# EAGLE schematic acoustics (EAGLE 9.1.3)

## Sheet 1 of 5: Connectors
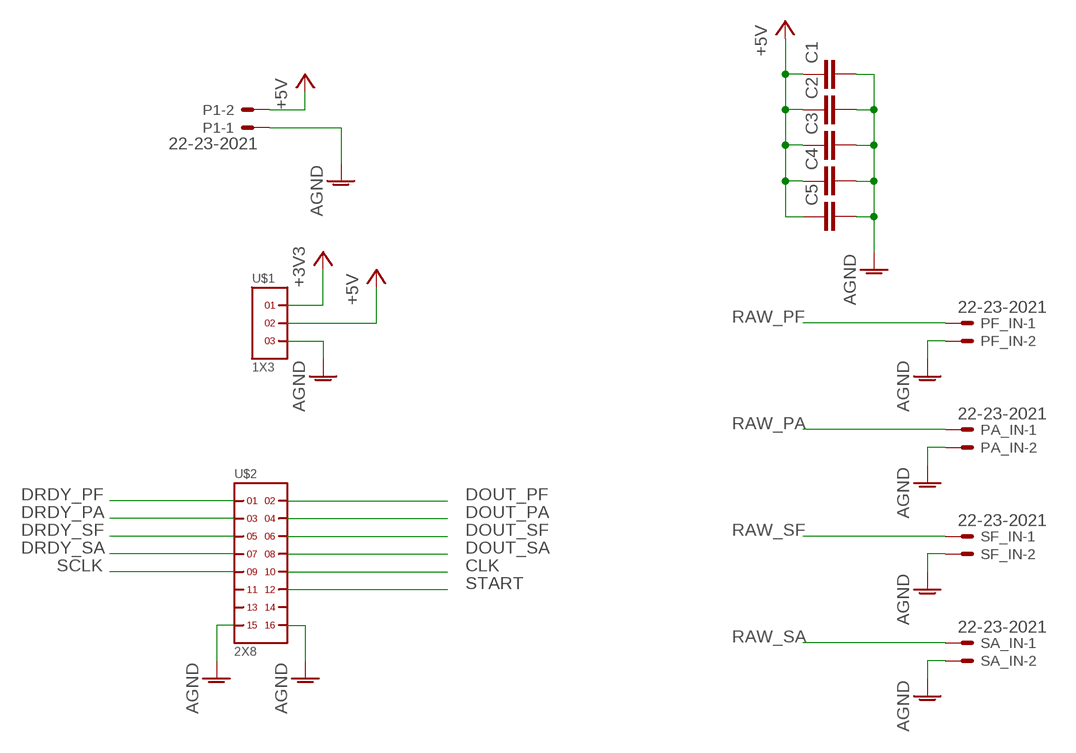
[diagram p0: schematic, sheet 1]

### Parts
C1  C2,5-3  [C2.5-3]
C2  C2,5-3  [C2.5-3]
C3  C2,5-3  [C2.5-3]
C4  C2,5-3  [C2.5-3]
C5  C2,5-3  [C2.5-3]
P1  22-23-2021  [22-23-2021]
PA_IN  22-23-2021  [22-23-2021]
PF_IN  22-23-2021  [22-23-2021]
SA_IN  22-23-2021  [22-23-2021]
SF_IN  22-23-2021  [22-23-2021]
U$1  1X3  [1X3]
U$2  2X8  [2X8]

### Nets
+3V3: U$1.1 ; also sheet 2,3,4,5
+5V: C1.1 C2.1 C3.1 C4.1 C5.1 P1.2 U$1.2
CLK: U$2.10 ; also sheet 5
DOUT_PA: U$2.4 ; also sheet 5
DOUT_PF: U$2.2 ; also sheet 5
DOUT_SA: U$2.8 ; also sheet 5
DOUT_SF: U$2.6 ; also sheet 5
DRDY_PA: U$2.3 ; also sheet 5
DRDY_PF: U$2.1 ; also sheet 5
DRDY_SA: U$2.7 ; also sheet 5
DRDY_SF: U$2.5 ; also sheet 5
GND: C1.2 C2.2 C3.2 C4.2 C5.2 P1.1 PA_IN.2 PF_IN.2 SA_IN.2 SF_IN.2 U$1.3 U$2.15 U$2.16 ; supply symbol labelled AGND ; also sheet 2,3,4,5
RAW_PA: PA_IN.1 ; also sheet 2
RAW_PF: PF_IN.1 ; also sheet 2
RAW_SA: SA_IN.1 ; also sheet 2
RAW_SF: SF_IN.1 ; also sheet 2
SCLK: U$2.9 ; also sheet 5
START: U$2.12 ; also sheet 5
Unconnected: U$2.11 U$2.13 U$2.14

## Sheet 2 of 5: Pre-amp
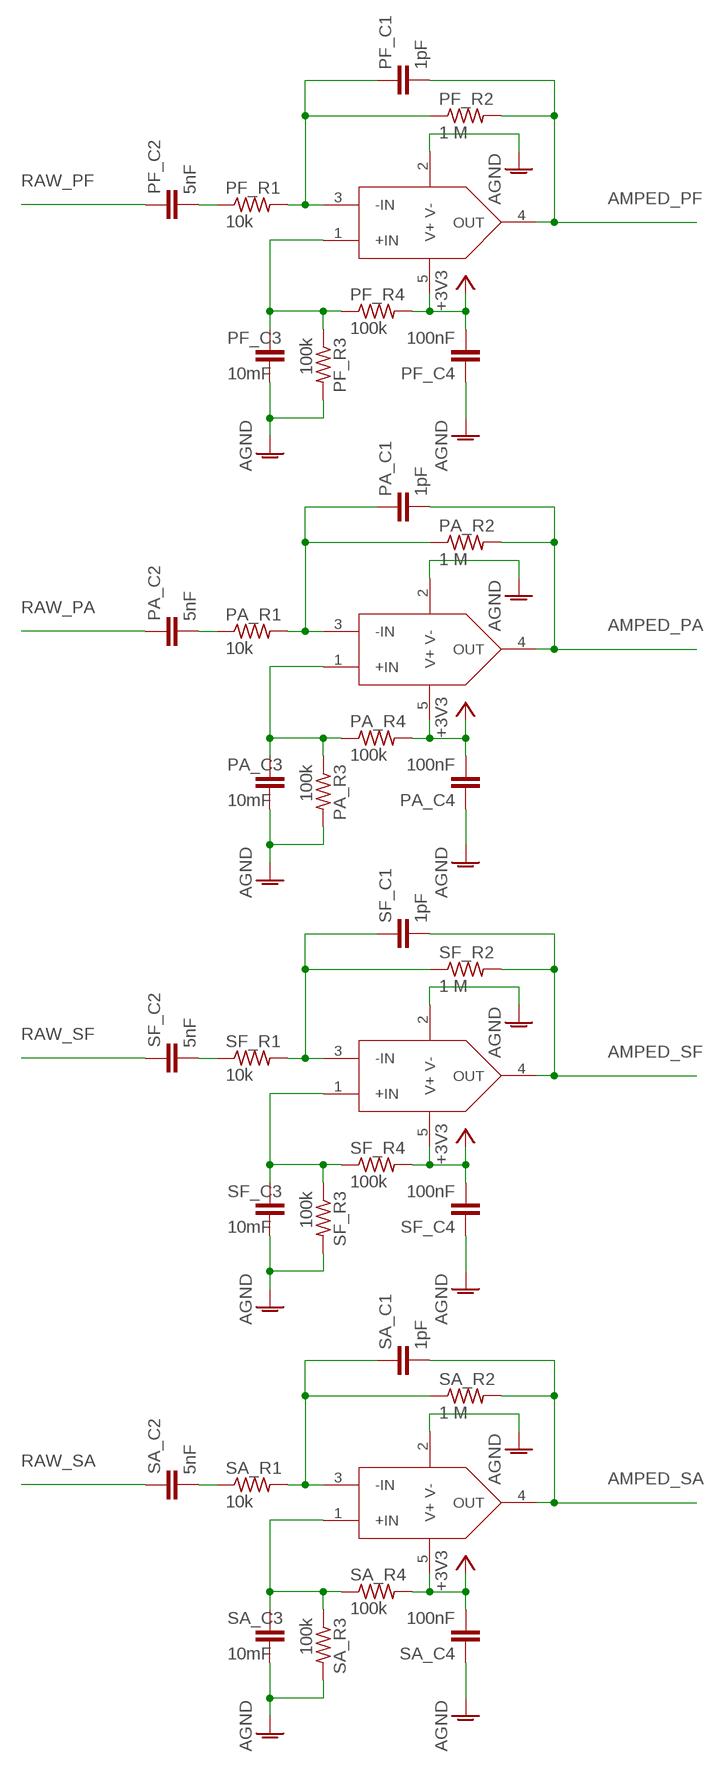
[diagram p1: schematic, sheet 2]

### Parts
H4_PREAMP4  TLV6741  [SC70-5]
PA_C1  1pF  C-EUC0603  [C0603]
PA_C2  5nF  C-EUC0603  [C0603]
PA_C3  10mF  C-EUC0603  [C0603]
PA_C4  100nF  C-EUC0603  [C0603]
PA_PREAMP  TLV6741  [SC70-5]
PA_R1  10k  R-US_R0603  [R0603]
PA_R2  1 M  R-US_R0603  [R0603]
PA_R3  100k  R-US_R0603  [R0603]
PA_R4  100k  R-US_R0603  [R0603]
PF_C1  1pF  C-EUC0603  [C0603]
PF_C2  5nF  C-EUC0603  [C0603]
PF_C3  10mF  C-EUC0603  [C0603]
PF_C4  100nF  C-EUC0603  [C0603]
PF_PREAMP  TLV6741  [SC70-5]
PF_R1  10k  R-US_R0603  [R0603]
PF_R2  1 M  R-US_R0603  [R0603]
PF_R3  100k  R-US_R0603  [R0603]
PF_R4  100k  R-US_R0603  [R0603]
SA_C1  1pF  C-EUC0603  [C0603]
SA_C2  5nF  C-EUC0603  [C0603]
SA_C3  10mF  C-EUC0603  [C0603]
SA_C4  100nF  C-EUC0603  [C0603]
SA_R1  10k  R-US_R0603  [R0603]
SA_R2  1 M  R-US_R0603  [R0603]
SA_R3  100k  R-US_R0603  [R0603]
SA_R4  100k  R-US_R0603  [R0603]
SF_C1  1pF  C-EUC0603  [C0603]
SF_C2  5nF  C-EUC0603  [C0603]
SF_C3  10mF  C-EUC0603  [C0603]
SF_C4  100nF  C-EUC0603  [C0603]
SF_PREAMP3  TLV6741  [SC70-5]
SF_R1  10k  R-US_R0603  [R0603]
SF_R2  1 M  R-US_R0603  [R0603]
SF_R3  100k  R-US_R0603  [R0603]
SF_R4  100k  R-US_R0603  [R0603]

### Nets
+3V3: H4_PREAMP4.5(V+) PA_C4.2 PA_PREAMP.5(V+) PA_R4.2 PF_C4.2 PF_PREAMP.5(V+) PF_R4.2 SA_C4.2 SA_R4.2 SF_C4.2 SF_PREAMP3.5(V+) SF_R4.2 ; also sheet 1,3,4,5
AMPED_PA: PA_C1.2 PA_PREAMP.4(OUT) PA_R2.2 ; also sheet 3
AMPED_PF: PF_C1.2 PF_PREAMP.4(OUT) PF_R2.2 ; also sheet 3
AMPED_SA: H4_PREAMP4.4(OUT) SA_C1.2 SA_R2.2 ; also sheet 3
AMPED_SF: SF_C1.2 SF_PREAMP3.4(OUT) SF_R2.2 ; also sheet 3
GND: H4_PREAMP4.2(V-) PA_C3.2 PA_C4.1 PA_PREAMP.2(V-) PA_R3.2 PF_C3.2 PF_C4.1 PF_PREAMP.2(V-) PF_R3.2 SA_C3.2 SA_C4.1 SA_R3.2 SF_C3.2 SF_C4.1 SF_PREAMP3.2(V-) SF_R3.2 ; supply symbol labelled AGND ; also sheet 1,3,4,5
N$133: PF_C2.2 PF_R1.1
N$134: PF_C1.1 PF_PREAMP.3(-IN) PF_R1.2 PF_R2.1
N$135: PF_C3.1 PF_PREAMP.1(+IN) PF_R3.1 PF_R4.1
N$137: PA_C2.2 PA_R1.1
N$138: PA_C1.1 PA_PREAMP.3(-IN) PA_R1.2 PA_R2.1
N$139: PA_C3.1 PA_PREAMP.1(+IN) PA_R3.1 PA_R4.1
N$141: SF_C2.2 SF_R1.1
N$142: SF_C1.1 SF_PREAMP3.3(-IN) SF_R1.2 SF_R2.1
N$143: SF_C3.1 SF_PREAMP3.1(+IN) SF_R3.1 SF_R4.1
N$145: SA_C2.2 SA_R1.1
N$146: H4_PREAMP4.3(-IN) SA_C1.1 SA_R1.2 SA_R2.1
N$147: H4_PREAMP4.1(+IN) SA_C3.1 SA_R3.1 SA_R4.1
RAW_PA: PA_C2.1 ; also sheet 1
RAW_PF: PF_C2.1 ; also sheet 1
RAW_SA: SA_C2.1 ; also sheet 1
RAW_SF: SF_C2.1 ; also sheet 1

## Sheet 3 of 5: Differential amplifier
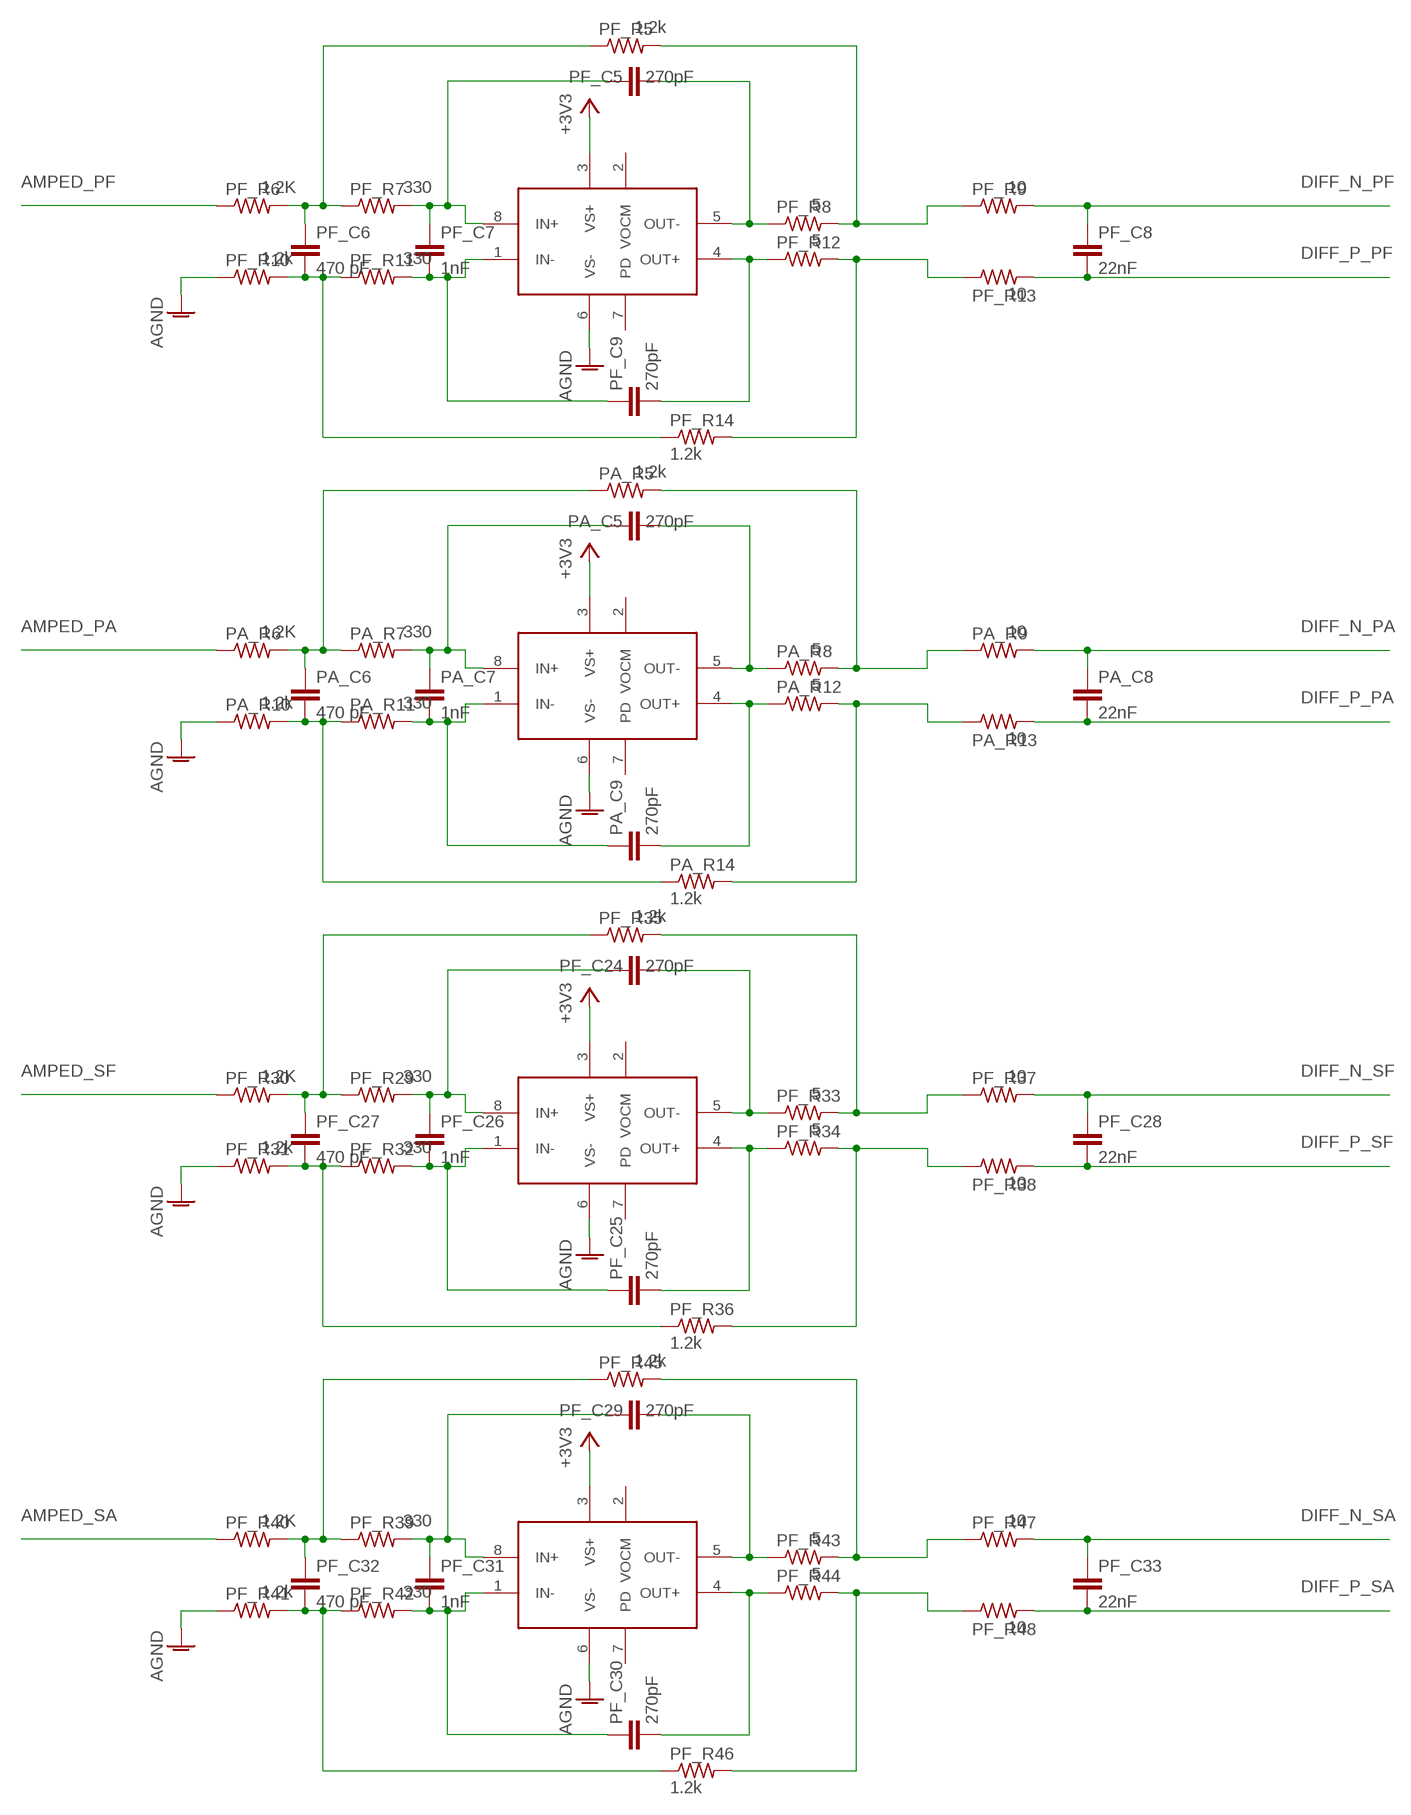
[diagram p2: schematic, sheet 3]

### Parts
PA_C5  270pF  C-EUC0603  [C0603]
PA_C6  470 pF  C-EUC0603  [C0603]
PA_C7  1nF  C-EUC0603  [C0603]
PA_C8  22nF  C-EUC0603  [C0603]
PA_C9  270pF  C-EUC0603  [C0603]
PA_DA  THS4551  [VSSOP-8]
PA_R5  1.2k  R-US_R0603  [R0603]
PA_R6  1.2K  R-US_R0603  [R0603]
PA_R7  330  R-US_R0603  [R0603]
PA_R8  5  R-US_R0603  [R0603]
PA_R9  10  R-US_R0603  [R0603]
PA_R10  1.2k  R-US_R0603  [R0603]
PA_R11  330  R-US_R0603  [R0603]
PA_R12  5  R-US_R0603  [R0603]
PA_R13  10  R-US_R0603  [R0603]
PA_R14  1.2k  R-US_R0603  [R0603]
PF_C5  270pF  C-EUC0603  [C0603]
PF_C6  470 pF  C-EUC0603  [C0603]
PF_C7  1nF  C-EUC0603  [C0603]
PF_C8  22nF  C-EUC0603  [C0603]
PF_C9  270pF  C-EUC0603  [C0603]
PF_C24  270pF  C-EUC0603  [C0603]
PF_C25  270pF  C-EUC0603  [C0603]
PF_C26  1nF  C-EUC0603  [C0603]
PF_C27  470 pF  C-EUC0603  [C0603]
PF_C28  22nF  C-EUC0603  [C0603]
PF_C29  270pF  C-EUC0603  [C0603]
PF_C30  270pF  C-EUC0603  [C0603]
PF_C31  1nF  C-EUC0603  [C0603]
PF_C32  470 pF  C-EUC0603  [C0603]
PF_C33  22nF  C-EUC0603  [C0603]
PF_DA  THS4551  [VSSOP-8]
PF_DA2  THS4551  [VSSOP-8]
PF_DA3  THS4551  [VSSOP-8]
PF_R5  1.2k  R-US_R0603  [R0603]
PF_R6  1.2K  R-US_R0603  [R0603]
PF_R7  330  R-US_R0603  [R0603]
PF_R8  5  R-US_R0603  [R0603]
PF_R9  10  R-US_R0603  [R0603]
PF_R10  1.2k  R-US_R0603  [R0603]
PF_R11  330  R-US_R0603  [R0603]
PF_R12  5  R-US_R0603  [R0603]
PF_R13  10  R-US_R0603  [R0603]
PF_R14  1.2k  R-US_R0603  [R0603]
PF_R29  330  R-US_R0603  [R0603]
PF_R30  1.2K  R-US_R0603  [R0603]
PF_R31  1.2k  R-US_R0603  [R0603]
PF_R32  330  R-US_R0603  [R0603]
PF_R33  5  R-US_R0603  [R0603]
PF_R34  5  R-US_R0603  [R0603]
PF_R35  1.2k  R-US_R0603  [R0603]
PF_R36  1.2k  R-US_R0603  [R0603]
PF_R37  10  R-US_R0603  [R0603]
PF_R38  10  R-US_R0603  [R0603]
PF_R39  330  R-US_R0603  [R0603]
PF_R40  1.2K  R-US_R0603  [R0603]
PF_R41  1.2k  R-US_R0603  [R0603]
PF_R42  330  R-US_R0603  [R0603]
PF_R43  5  R-US_R0603  [R0603]
PF_R44  5  R-US_R0603  [R0603]
PF_R45  1.2k  R-US_R0603  [R0603]
PF_R46  1.2k  R-US_R0603  [R0603]
PF_R47  10  R-US_R0603  [R0603]
PF_R48  10  R-US_R0603  [R0603]

### Nets
+3V3: PA_DA.3(VS+) PF_DA2.3(VS+) PF_DA3.3(VS+) PF_DA.3(VS+) ; also sheet 1,2,4,5
AMPED_PA: PA_R6.1 ; also sheet 2
AMPED_PF: PF_R6.1 ; also sheet 2
AMPED_SA: PF_R40.1 ; also sheet 2
AMPED_SF: PF_R30.1 ; also sheet 2
DIFF_N_PA: PA_C8.1 PA_R9.2 ; also sheet 5
DIFF_N_PF: PF_C8.1 PF_R9.2 ; also sheet 5
DIFF_N_SA: PF_C33.1 PF_R47.2 ; also sheet 5
DIFF_N_SF: PF_C28.1 PF_R37.2 ; also sheet 5
DIFF_P_PA: PA_C8.2 PA_R13.2 ; also sheet 5
DIFF_P_PF: PF_C8.2 PF_R13.2 ; also sheet 5
DIFF_P_SA: PF_C33.2 PF_R48.2 ; also sheet 5
DIFF_P_SF: PF_C28.2 PF_R38.2 ; also sheet 5
GND: PA_DA.6(VS-) PA_R10.1 PF_DA2.6(VS-) PF_DA3.6(VS-) PF_DA.6(VS-) PF_R10.1 PF_R31.1 PF_R41.1 ; supply symbol labelled AGND ; also sheet 1,2,4,5
N$1: PA_C5.2 PA_DA.5(OUT-) PA_R8.1
N$2: PA_C5.1 PA_C7.1 PA_DA.8(IN+) PA_R7.2
N$3: PA_C7.2 PA_C9.1 PA_DA.1(IN-) PA_R11.2
N$4: PA_C6.1 PA_R5.1 PA_R6.2 PA_R7.1
N$5: PA_C6.2 PA_R10.2 PA_R11.1 PA_R14.1
N$6: PA_C9.2 PA_DA.4(OUT+) PA_R12.1
N$7: PA_R5.2 PA_R8.2 PA_R9.1
N$8: PA_R12.2 PA_R13.1 PA_R14.2
N$9: PF_C24.2 PF_DA2.5(OUT-) PF_R33.1
N$10: PF_C24.1 PF_C26.1 PF_DA2.8(IN+) PF_R29.2
N$11: PF_C25.1 PF_C26.2 PF_DA2.1(IN-) PF_R32.2
N$12: PF_C27.1 PF_R29.1 PF_R30.2 PF_R35.1
N$13: PF_C27.2 PF_R31.2 PF_R32.1 PF_R36.1
N$14: PF_C25.2 PF_DA2.4(OUT+) PF_R34.1
N$15: PF_R33.2 PF_R35.2 PF_R37.1
N$16: PF_R34.2 PF_R36.2 PF_R38.1
N$17: PF_C29.2 PF_DA3.5(OUT-) PF_R43.1
N$18: PF_C29.1 PF_C31.1 PF_DA3.8(IN+) PF_R39.2
N$19: PF_C30.1 PF_C31.2 PF_DA3.1(IN-) PF_R42.2
N$20: PF_C32.1 PF_R39.1 PF_R40.2 PF_R45.1
N$21: PF_C32.2 PF_R41.2 PF_R42.1 PF_R46.1
N$22: PF_C30.2 PF_DA3.4(OUT+) PF_R44.1
N$23: PF_R43.2 PF_R45.2 PF_R47.1
N$24: PF_R44.2 PF_R46.2 PF_R48.1
N$88: PF_R12.2 PF_R13.1 PF_R14.2
N$97: PF_C5.2 PF_DA.5(OUT-) PF_R8.1
N$98: PF_C5.1 PF_C7.1 PF_DA.8(IN+) PF_R7.2
N$99: PF_C7.2 PF_C9.1 PF_DA.1(IN-) PF_R11.2
N$100: PF_C6.1 PF_R5.1 PF_R6.2 PF_R7.1
N$101: PF_C6.2 PF_R10.2 PF_R11.1 PF_R14.1
N$102: PF_C9.2 PF_DA.4(OUT+) PF_R12.1
N$109: PF_R5.2 PF_R8.2 PF_R9.1
Unconnected: PA_DA.2(VOCM) PA_DA.7(PD) PF_DA2.2(VOCM) PF_DA2.7(PD) PF_DA3.2(VOCM) PF_DA3.7(PD) PF_DA.2(VOCM) PF_DA.7(PD)

## Sheet 4 of 5: Voltage Reference
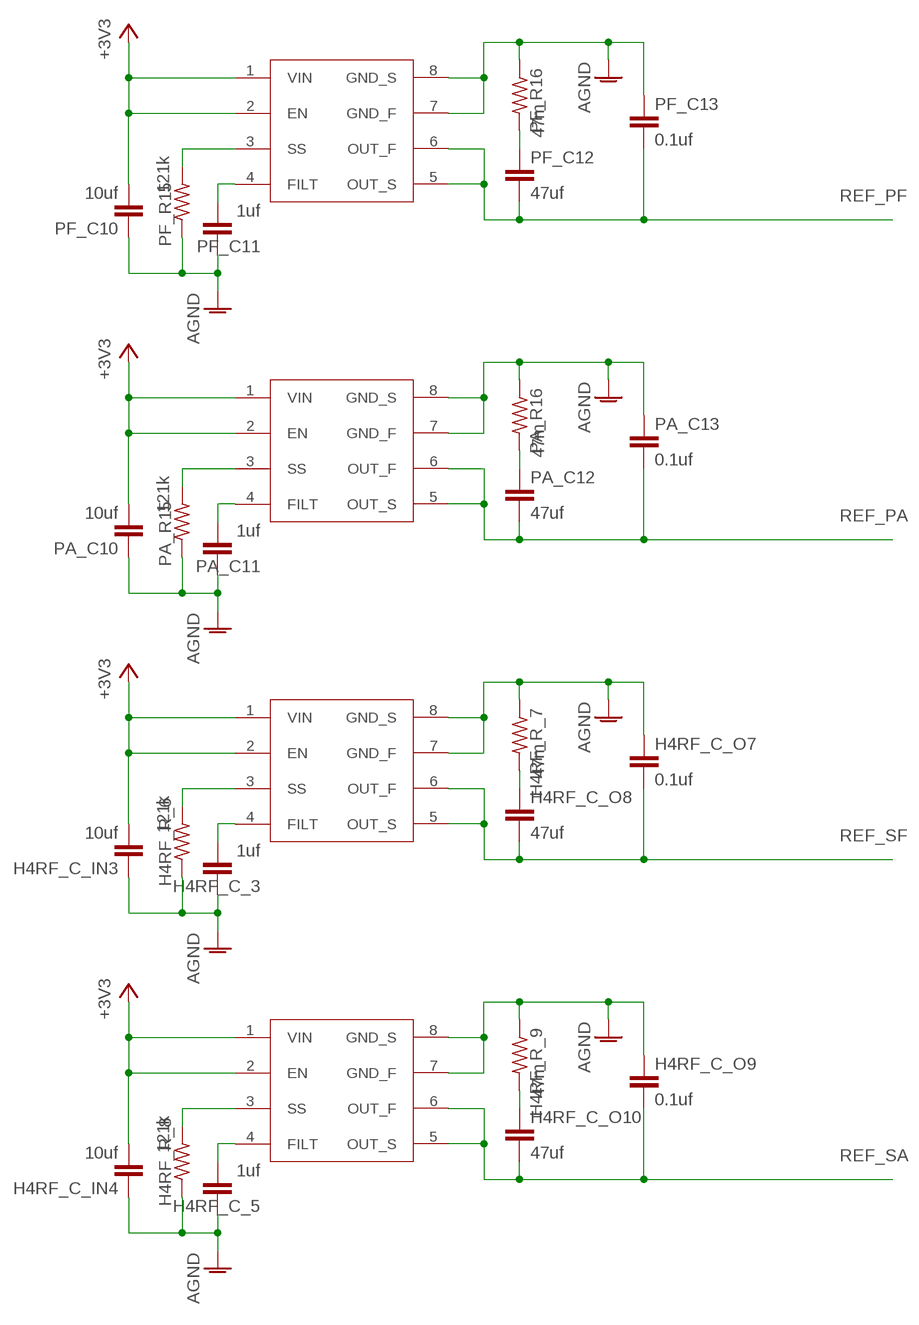
[diagram p3: schematic, sheet 4]

### Parts
H4_REFGEN3  REF6025  [REF6025]
H4_REFGEN4  REF6025  [REF6025]
H4RF_C_3  1uf  C-EUC0603  [C0603]
H4RF_C_5  1uf  C-EUC0603  [C0603]
H4RF_C_IN3  10uf  C-EUC0603  [C0603]
H4RF_C_IN4  10uf  C-EUC0603  [C0603]
H4RF_C_O7  0.1uf  C-EUC0603  [C0603]
H4RF_C_O8  47uf  C-EUC0603  [C0603]
H4RF_C_O9  0.1uf  C-EUC0603  [C0603]
H4RF_C_O10  47uf  C-EUC0603  [C0603]
H4RF_R_6  121k  R-US_R0603  [R0603]
H4RF_R_7  47m  R-US_R0603  [R0603]
H4RF_R_8  121k  R-US_R0603  [R0603]
H4RF_R_9  47m  R-US_R0603  [R0603]
PA_C10  10uf  C-EUC0603  [C0603]
PA_C11  1uf  C-EUC0603  [C0603]
PA_C12  47uf  C-EUC0603  [C0603]
PA_C13  0.1uf  C-EUC0603  [C0603]
PA_R15  121k  R-US_R0603  [R0603]
PA_R16  47m  R-US_R0603  [R0603]
PA_REFGEN  REF6025  [REF6025]
PF_C10  10uf  C-EUC0603  [C0603]
PF_C11  1uf  C-EUC0603  [C0603]
PF_C12  47uf  C-EUC0603  [C0603]
PF_C13  0.1uf  C-EUC0603  [C0603]
PF_R15  121k  R-US_R0603  [R0603]
PF_R16  47m  R-US_R0603  [R0603]
PF_REFGEN  REF6025  [REF6025]

### Nets
+3V3: H4_REFGEN3.1(VIN) H4_REFGEN3.2(EN) H4_REFGEN4.1(VIN) H4_REFGEN4.2(EN) H4RF_C_IN3.2 H4RF_C_IN4.2 PA_C10.2 PA_REFGEN.1(VIN) PA_REFGEN.2(EN) PF_C10.2 PF_REFGEN.1(VIN) PF_REFGEN.2(EN) ; also sheet 1,2,3,5
GND: H4_REFGEN3.7(GND_F) H4_REFGEN3.8(GND_S) H4_REFGEN4.7(GND_F) H4_REFGEN4.8(GND_S) H4RF_C_3.1 H4RF_C_5.1 H4RF_C_IN3.1 H4RF_C_IN4.1 H4RF_C_O7.1 H4RF_C_O9.1 H4RF_R_6.1 H4RF_R_7.1 H4RF_R_8.1 H4RF_R_9.1 PA_C10.1 PA_C11.1 PA_C13.1 PA_R15.1 PA_R16.1 PA_REFGEN.7(GND_F) PA_REFGEN.8(GND_S) PF_C10.1 PF_C11.1 PF_C13.1 PF_R15.1 PF_R16.1 PF_REFGEN.7(GND_F) PF_REFGEN.8(GND_S) ; supply symbol labelled AGND ; also sheet 1,2,3,5
N$103: PF_C11.2 PF_REFGEN.4(FILT)
N$104: PF_R15.2 PF_REFGEN.3(SS)
N$105: PF_C12.1 PF_R16.2
N$110: PA_C11.2 PA_REFGEN.4(FILT)
N$116: PA_R15.2 PA_REFGEN.3(SS)
N$117: PA_C12.1 PA_R16.2
N$118: H4_REFGEN3.4(FILT) H4RF_C_3.2
N$121: H4_REFGEN3.3(SS) H4RF_R_6.2
N$124: H4RF_C_O8.1 H4RF_R_7.2
N$129: H4_REFGEN4.4(FILT) H4RF_C_5.2
N$130: H4_REFGEN4.3(SS) H4RF_R_8.2
N$131: H4RF_C_O10.1 H4RF_R_9.2
REF_PA: PA_C12.2 PA_C13.2 PA_REFGEN.5(OUT_S) PA_REFGEN.6(OUT_F) ; also sheet 5
REF_PF: PF_C12.2 PF_C13.2 PF_REFGEN.5(OUT_S) PF_REFGEN.6(OUT_F) ; also sheet 5
REF_SA: H4_REFGEN4.5(OUT_S) H4_REFGEN4.6(OUT_F) H4RF_C_O9.2 H4RF_C_O10.2 ; also sheet 5
REF_SF: H4_REFGEN3.5(OUT_S) H4_REFGEN3.6(OUT_F) H4RF_C_O7.2 H4RF_C_O8.2 ; also sheet 5

## Sheet 5 of 5: ADCs
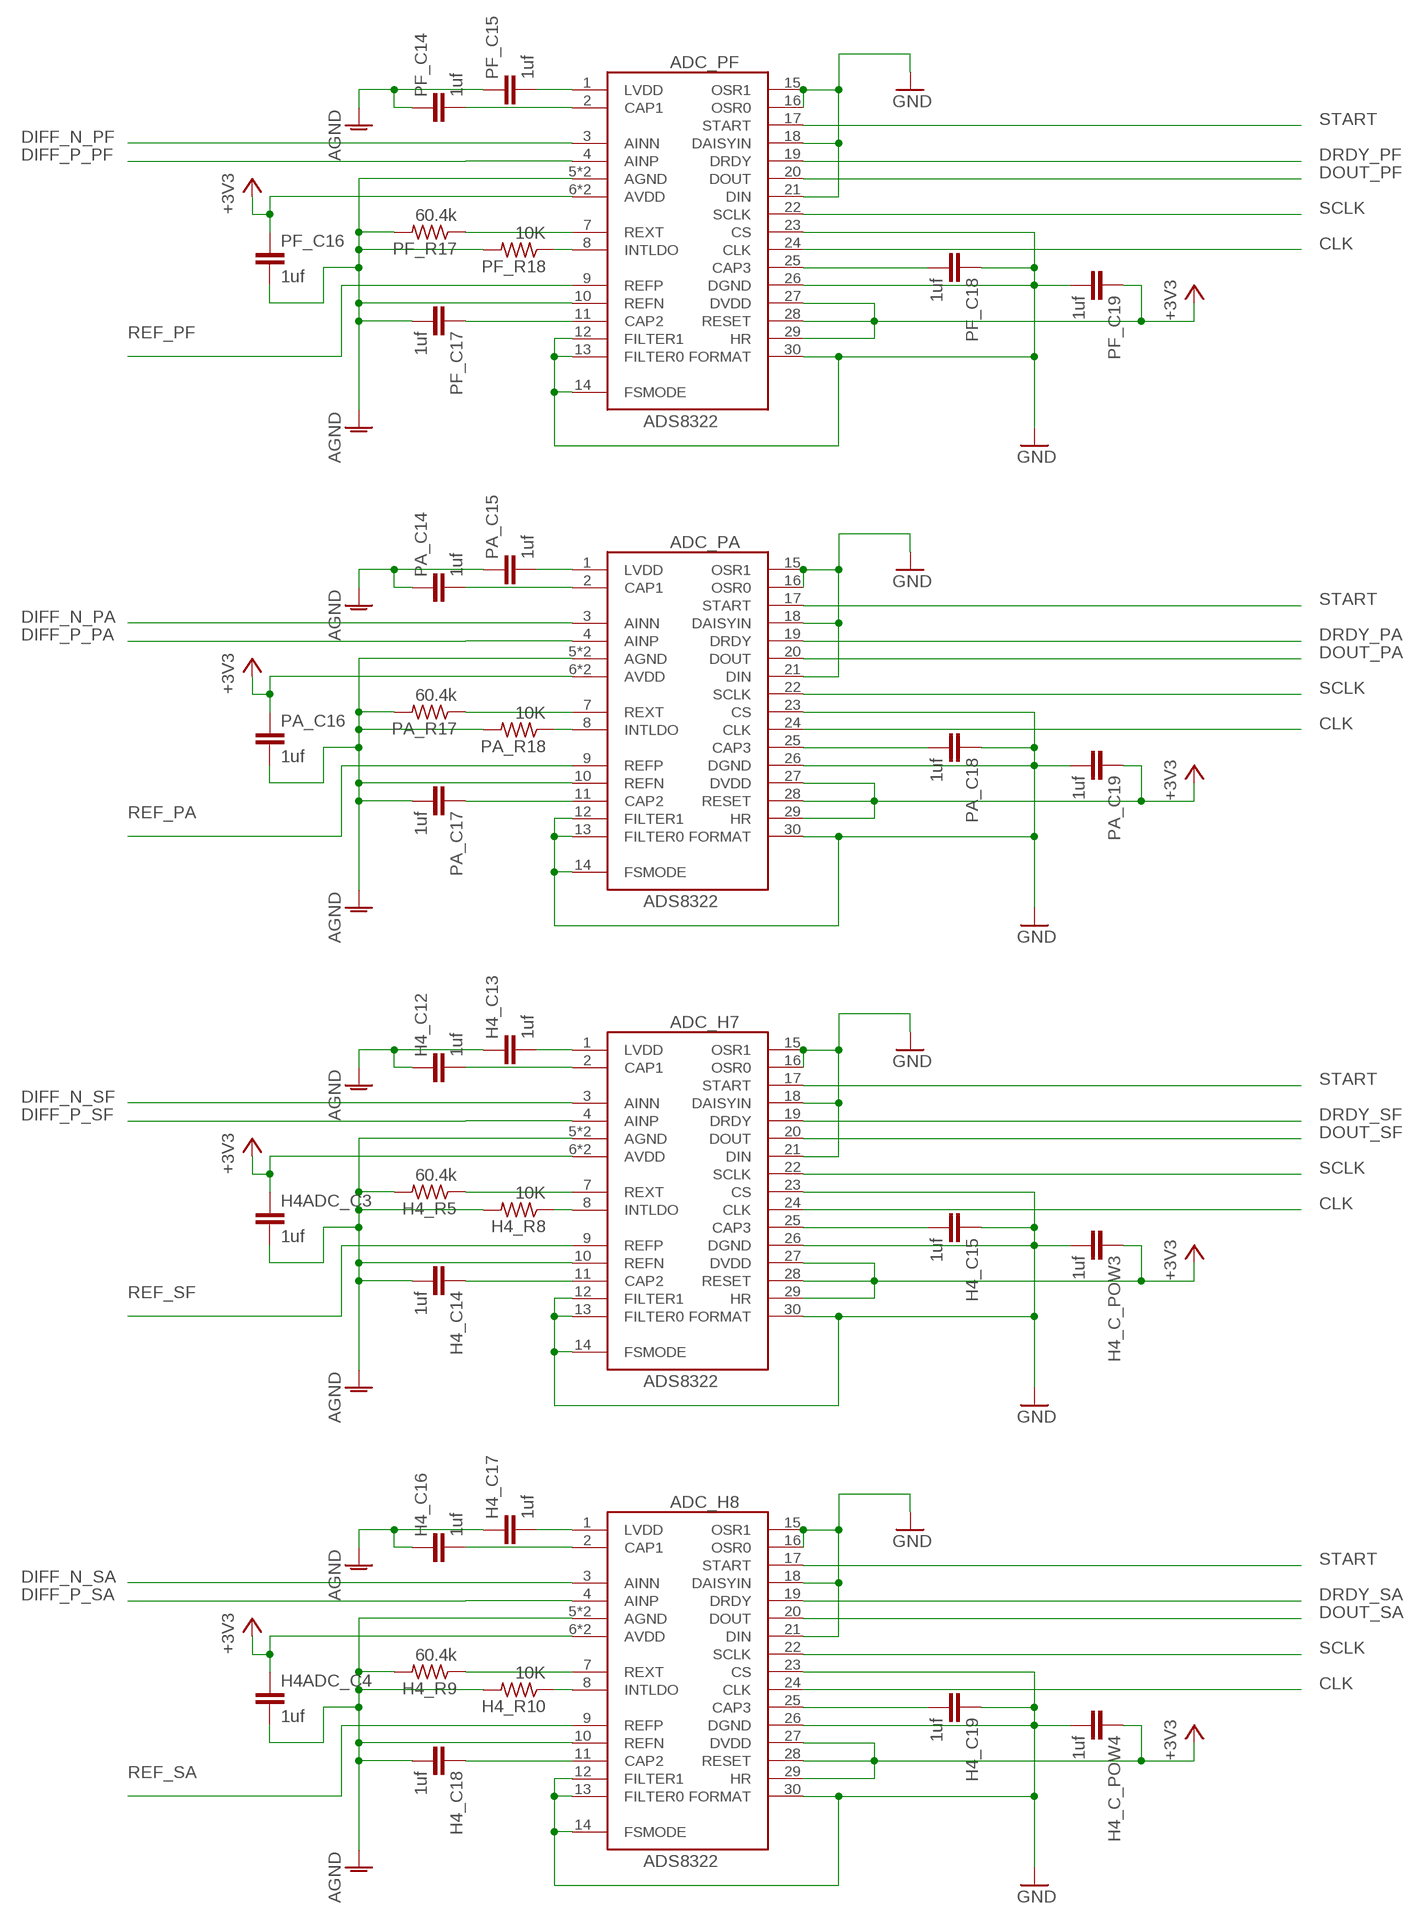
[diagram p4: schematic, sheet 5]

### Parts
ADC_H7  ADS8322  [TQFP-32]
ADC_H8  ADS8322  [TQFP-32]
ADC_PA  ADS8322  [TQFP-32]
ADC_PF  ADS8322  [TQFP-32]
H4_C12  1uf  C-EUC0603  [C0603]
H4_C13  1uf  C-EUC0603  [C0603]
H4_C14  1uf  C-EUC0603  [C0603]
H4_C15  1uf  C-EUC0603  [C0603]
H4_C16  1uf  C-EUC0603  [C0603]
H4_C17  1uf  C-EUC0603  [C0603]
H4_C18  1uf  C-EUC0603  [C0603]
H4_C19  1uf  C-EUC0603  [C0603]
H4_C_POW3  1uf  C-EUC0603  [C0603]
H4_C_POW4  1uf  C-EUC0603  [C0603]
H4_R5  60.4k  R-US_R0603  [R0603]
H4_R8  10K  R-US_R0603  [R0603]
H4_R9  60.4k  R-US_R0603  [R0603]
H4_R10  10K  R-US_R0603  [R0603]
H4ADC_C3  1uf  C-EUC0603K  [C0603K]
H4ADC_C4  1uf  C-EUC0603K  [C0603K]
PA_C14  1uf  C-EUC0603  [C0603]
PA_C15  1uf  C-EUC0603  [C0603]
PA_C16  1uf  C-EUC0603K  [C0603K]
PA_C17  1uf  C-EUC0603  [C0603]
PA_C18  1uf  C-EUC0603  [C0603]
PA_C19  1uf  C-EUC0603  [C0603]
PA_R17  60.4k  R-US_R0603  [R0603]
PA_R18  10K  R-US_R0603  [R0603]
PF_C14  1uf  C-EUC0603  [C0603]
PF_C15  1uf  C-EUC0603  [C0603]
PF_C16  1uf  C-EUC0603K  [C0603K]
PF_C17  1uf  C-EUC0603  [C0603]
PF_C18  1uf  C-EUC0603  [C0603]
PF_C19  1uf  C-EUC0603  [C0603]
PF_R17  60.4k  R-US_R0603  [R0603]
PF_R18  10K  R-US_R0603  [R0603]

### Nets
+3V3: ADC_H7.6(AVDD) ADC_H7.27(DVDD) ADC_H7.28(RESET) ADC_H7.29(HR) ADC_H7.32(AVDD) ADC_H8.6(AVDD) ADC_H8.27(DVDD) ADC_H8.28(RESET) ADC_H8.29(HR) ADC_H8.32(AVDD) ADC_PA.6(AVDD) ADC_PA.27(DVDD) ADC_PA.28(RESET) ADC_PA.29(HR) ADC_PA.32(AVDD) ADC_PF.6(AVDD) ADC_PF.27(DVDD) ADC_PF.28(RESET) ADC_PF.29(HR) ADC_PF.32(AVDD) H4_C_POW3.1 H4_C_POW4.1 H4ADC_C3.1 H4ADC_C4.1 PA_C16.1 PA_C19.1 PF_C16.1 PF_C19.1 ; also sheet 1,2,3,4
CLK: ADC_H7.24(CLK) ADC_H8.24(CLK) ADC_PA.24(CLK) ADC_PF.24(CLK) ; also sheet 1
DIFF_N_PA: ADC_PA.3(AINN) ; also sheet 3
DIFF_N_PF: ADC_PF.3(AINN) ; also sheet 3
DIFF_N_SA: ADC_H8.3(AINN) ; also sheet 3
DIFF_N_SF: ADC_H7.3(AINN) ; also sheet 3
DIFF_P_PA: ADC_PA.4(AINP) ; also sheet 3
DIFF_P_PF: ADC_PF.4(AINP) ; also sheet 3
DIFF_P_SA: ADC_H8.4(AINP) ; also sheet 3
DIFF_P_SF: ADC_H7.4(AINP) ; also sheet 3
DOUT_PA: ADC_PA.20(DOUT) ; also sheet 1
DOUT_PF: ADC_PF.20(DOUT) ; also sheet 1
DOUT_SA: ADC_H8.20(DOUT) ; also sheet 1
DOUT_SF: ADC_H7.20(DOUT) ; also sheet 1
DRDY_PA: ADC_PA.19(DRDY) ; also sheet 1
DRDY_PF: ADC_PF.19(DRDY) ; also sheet 1
DRDY_SA: ADC_H8.19(DRDY) ; also sheet 1
DRDY_SF: ADC_H7.19(DRDY) ; also sheet 1
GND: ADC_H7.5(AGND) ADC_H7.10(REFN) ADC_H7.12(FILTER1) ADC_H7.13(FILTER0) ADC_H7.14(FSMODE) ADC_H7.15(OSR1) ADC_H7.16(OSR0) ADC_H7.18(DAISYIN) ADC_H7.21(DIN) ADC_H7.23(CS) ADC_H7.26(DGND) ADC_H7.30(FORMAT) ADC_H7.31(AGND) ADC_H8.5(AGND) ADC_H8.10(REFN) ADC_H8.12(FILTER1) ADC_H8.13(FILTER0) ADC_H8.14(FSMODE) ADC_H8.15(OSR1) ADC_H8.16(OSR0) ADC_H8.18(DAISYIN) ADC_H8.21(DIN) ADC_H8.23(CS) ADC_H8.26(DGND) ADC_H8.30(FORMAT) ADC_H8.31(AGND) ADC_PA.5(AGND) ADC_PA.10(REFN) ADC_PA.12(FILTER1) ADC_PA.13(FILTER0) ADC_PA.14(FSMODE) ADC_PA.15(OSR1) ADC_PA.16(OSR0) ADC_PA.18(DAISYIN) ADC_PA.21(DIN) ADC_PA.23(CS) ADC_PA.26(DGND) ADC_PA.30(FORMAT) ADC_PA.31(AGND) ADC_PF.5(AGND) ADC_PF.10(REFN) ADC_PF.12(FILTER1) ADC_PF.13(FILTER0) ADC_PF.14(FSMODE) ADC_PF.15(OSR1) ADC_PF.16(OSR0) ADC_PF.18(DAISYIN) ADC_PF.21(DIN) ADC_PF.23(CS) ADC_PF.26(DGND) ADC_PF.30(FORMAT) ADC_PF.31(AGND) H4_C12.1 H4_C13.1 H4_C14.2 H4_C15.1 H4_C16.1 H4_C17.1 H4_C18.2 H4_C19.1 H4_C_POW3.2 H4_C_POW4.2 H4_R5.2 H4_R8.2 H4_R9.2 H4_R10.2 H4ADC_C3.2 H4ADC_C4.2 PA_C14.1 PA_C15.1 PA_C16.2 PA_C17.2 PA_C18.1 PA_C19.2 PA_R17.2 PA_R18.2 PF_C14.1 PF_C15.1 PF_C16.2 PF_C17.2 PF_C18.1 PF_C19.2 PF_R17.2 PF_R18.2 ; supply symbol labelled AGND ; also sheet 1,2,3,4
N$132: ADC_PF.2(CAP1) PF_C14.2
N$136: ADC_PA.1(LVDD) PA_C15.2
N$140: ADC_PA.8(INTLDO) PA_R18.1
N$144: ADC_PA.7(REXT) PA_R17.1
N$148: ADC_PA.11(CAP2) PA_C17.1
N$149: ADC_PA.25(CAP3) PA_C18.2
N$150: ADC_PF.1(LVDD) PF_C15.2
N$151: ADC_PA.2(CAP1) PA_C14.2
N$152: ADC_PF.8(INTLDO) PF_R18.1
N$153: ADC_PF.7(REXT) PF_R17.1
N$154: ADC_PF.11(CAP2) PF_C17.1
N$155: ADC_PF.25(CAP3) PF_C18.2
N$156: ADC_H7.1(LVDD) H4_C13.2
N$157: ADC_H7.8(INTLDO) H4_R8.1
N$158: ADC_H7.7(REXT) H4_R5.1
N$159: ADC_H7.11(CAP2) H4_C14.1
N$160: ADC_H7.25(CAP3) H4_C15.2
N$161: ADC_H7.2(CAP1) H4_C12.2
N$162: ADC_H8.1(LVDD) H4_C17.2
N$163: ADC_H8.8(INTLDO) H4_R10.1
N$164: ADC_H8.7(REXT) H4_R9.1
N$165: ADC_H8.11(CAP2) H4_C18.1
N$166: ADC_H8.25(CAP3) H4_C19.2
N$167: ADC_H8.2(CAP1) H4_C16.2
REF_PA: ADC_PA.9(REFP) ; also sheet 4
REF_PF: ADC_PF.9(REFP) ; also sheet 4
REF_SA: ADC_H8.9(REFP) ; also sheet 4
REF_SF: ADC_H7.9(REFP) ; also sheet 4
SCLK: ADC_H7.22(SCLK) ADC_H8.22(SCLK) ADC_PA.22(SCLK) ADC_PF.22(SCLK) ; also sheet 1
START: ADC_H7.17(START) ADC_H8.17(START) ADC_PA.17(START) ADC_PF.17(START) ; also sheet 1

## Library data of the parts
ADC_H7 ADC_H8 ADC_PA ADC_PF = ti-ads8322:ADS8322: Texas Instruments ADS-8322 16-Bit, 500kHz ANALOG-TO-DIGITAL CONVERTER Features: high-speed parallel interface 500kHz sampling rate low power: 85mW at 500kHz internal 2.5V reference unipolar input range TQFP-32 package Package: TQFP-32 Based on the following source: SBAS215A-JULY 2001-REVISED JANUARY 2010 Created by: Bastian Göricke
C1-C5 = capacitor-wima:C: CAPACITOR naming: grid - package width
H4_C12-H4_C19 H4_C_POW3 H4_C_POW4 H4ADC_C3 H4ADC_C4 H4RF_C_3 H4RF_C_5 H4RF_C_IN3 H4RF_C_IN4 H4RF_C_O7-H4RF_C_O10 PA_C10-PA_C19 PF_C10-PF_C19 = rcl:C-EU: CAPACITOR, European symbol
H4_PREAMP4 PA_PREAMP PF_PREAMP SF_PREAMP3 = lio:TLV6741
H4_R5 H4_R8-H4_R10 PA_R17 PA_R18 PF_R17 PF_R18 = rcl:R-US_: RESISTOR, American symbol
H4_REFGEN3 H4_REFGEN4 PA_REFGEN PF_REFGEN = REF6025:REF6025
H4RF_R_6-H4RF_R_9 PA_R1-PA_R16 PF_R1-PF_R16 PF_R29-PF_R48 SA_R1-SA_R4 SF_R1-SF_R4 = resistor:R-US_: RESISTOR, American symbol
P1 PA_IN PF_IN SA_IN SF_IN = con-molex:22-23-2021: .100" (2.54mm) Center Header - 2 Pin; MF: MOLEX; MPN: 22-23-2021; OC_FARNELL: 1462926; OC_NEWARK: 25C3832
PA_C1-PA_C9 PF_C1-PF_C9 PF_C24-PF_C33 SA_C1-SA_C4 SF_C1-SF_C4 = resistor:C-EU: CAPACITOR, European symbol
PA_DA PF_DA PF_DA2 PF_DA3 = THS4551:THS4551
U$1 = headers(2mm):1X3
U$2 = headers(2mm):2X8